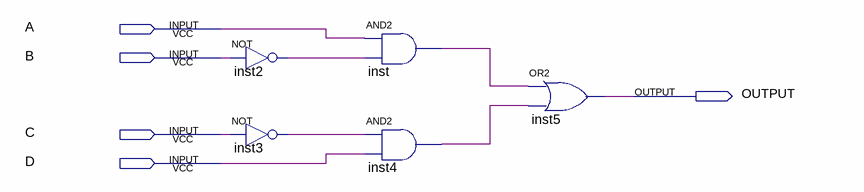
[diagram p0: schematic sheet]
// Quartus schematic HW1_P4.bdf as structural Verilog: 5 symbols, 5 pins
module HW1_P4 (
  input  A,
  input  B,
  input  C,
  input  D,
  output OUTPUT
);

  wire inst2_out, inst3_out, inst4_out, inst_out;

  not inst2 (inst2_out, B);
  not inst3 (inst3_out, C);
  and inst (inst_out, A, inst2_out);
  and inst4 (inst4_out, inst3_out, D);
  or inst5 (OUTPUT, inst_out, inst4_out);
endmodule
